# Altium project Earendel_Rules_Enabled_V2.PrjPcb
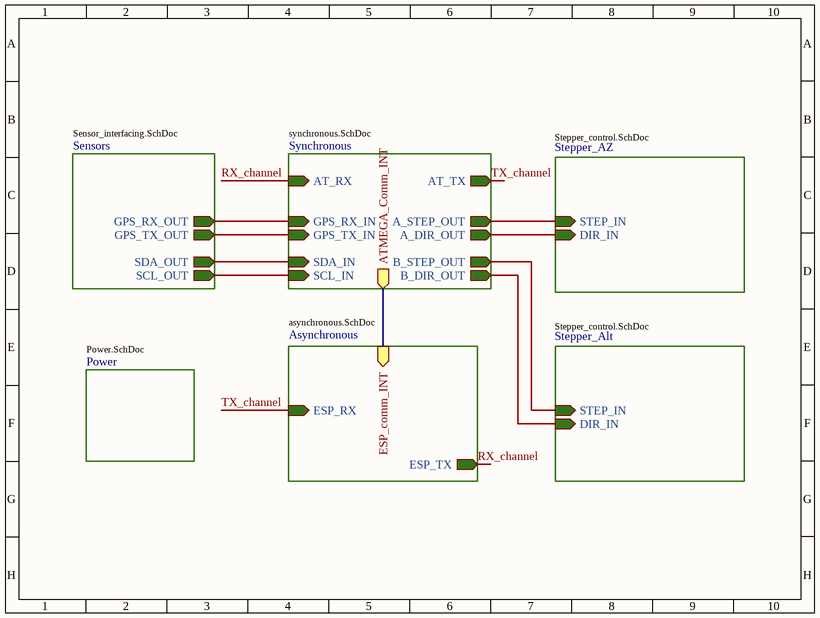
[diagram p0: Top_domain.SchDoc]
3 sheets, 26 parts. Net scope: hierarchical (ports join the sheet entries above them; power ports are global).
Board file: PCBmain.PcbDoc
Sheets:
  Top_domain.SchDoc
    Power = Power.SchDoc
    Synchronous = synchronous.SchDoc

## Sheet Top_domain.SchDoc
size 152 x 114 mm; SheetNumber: 1; SheetTotal: 6

### Sub-sheets
Asynchronous = asynchronous.SchDoc (file not in this document): ESP_RX (in), ESP_TX (out), ESP_comm_INT (in)
Power = Power.SchDoc: no entries
Sensors = Sensor_interfacing.SchDoc (file not in this document): GPS_RX_OUT (out), GPS_TX_OUT (out), SDA_OUT (out), SCL_OUT (out)
Stepper_Alt = Stepper_control.SchDoc (file not in this document): STEP_IN (in), DIR_IN (in)
Stepper_AZ = Stepper_control.SchDoc (file not in this document): STEP_IN (in), DIR_IN (in)
Synchronous = synchronous.SchDoc: AT_TX (out), AT_RX (in), GPS_RX_IN (in), GPS_TX_IN (in), SDA_IN (in), SCL_IN (in), A_STEP_OUT (out), B_STEP_OUT (out), A_DIR_OUT (out), B_DIR_OUT (out), ATMEGA_Comm_INT (out)

### Nets
RX_channel: sheet Synchronous/AT_RX, sheet Asynchronous/ESP_TX
SCL: sheet Synchronous/SCL_IN, sheet Sensors/SCL_OUT
SDA: sheet Synchronous/SDA_IN, sheet Sensors/SDA_OUT
TX_channel: sheet Synchronous/AT_TX, sheet Asynchronous/ESP_RX
NetU1_4: sheet Synchronous/ATMEGA_Comm_INT, sheet Asynchronous/ESP_comm_INT
NetU1_5: sheet Synchronous/GPS_TX_IN, sheet Sensors/GPS_TX_OUT
NetU1_6: sheet Synchronous/GPS_RX_IN, sheet Sensors/GPS_RX_OUT
NetU1_11: sheet Synchronous/A_STEP_OUT, sheet Stepper_AZ/STEP_IN
NetU1_12: sheet Synchronous/B_STEP_OUT, sheet Stepper_Alt/STEP_IN
NetU1_13: sheet Synchronous/A_DIR_OUT, sheet Stepper_AZ/DIR_IN
NetU1_14: sheet Synchronous/B_DIR_OUT, sheet Stepper_Alt/DIR_IN

## Sheet Power.SchDoc
size 114 x 152 mm; SheetNumber: 4; SheetTotal: 6
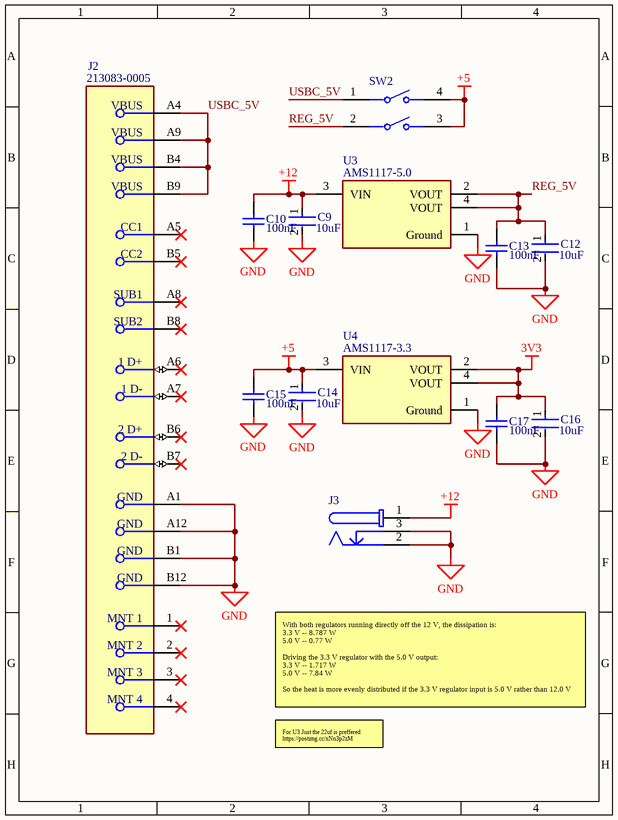
[diagram p1: Power.SchDoc]

### Parts
C9  Capacitance: 10uF  [FP-1206-L_3_2_0_2-W_1_6_0-IPC_B]  (hidden comment: 1206YD106KAT2A)
C10  value 100nF  [CAPC2013X140X50LL20T25]  (hidden comment: 08055F104KAT2A)
C12  Capacitance: 10uF  [FP-1206-L_3_2_0_2-W_1_6_0-IPC_B]  (hidden comment: 1206YD106KAT2A)
C13  value 100nF  [CAPC2013X140X50LL20T25]  (hidden comment: 08055F104KAT2A)
C14  Capacitance: 10uF  [FP-1206-L_3_2_0_2-W_1_6_0-IPC_B]  (hidden comment: 1206YD106KAT2A)
C15  value 100nF  [CAPC2013X140X50LL20T25]  (hidden comment: 08055F104KAT2A)
C16  Capacitance: 10uF  [FP-1206-L_3_2_0_2-W_1_6_0-IPC_B]  (hidden comment: 1206YD106KAT2A)
C17  value 100nF  [CAPC2013X140X50LL20T25]  (hidden comment: 08055F104KAT2A)
J2  213083-0005  [FP-2130830005-MFG]
J3  694106301002  [694106301002]  (value not drawn)
SW2  A6T-2104  [FP-A6T-2104-MFG]  (value not drawn)
U3  AMS1117-5.0  [FP-AMS1117-IPC_C]
U4  AMS1117-3.3  [FP-AMS1117-IPC_C]

### Nets
3V3: C16.1 C17.2 U4.2(VOUT) U4.4(VOUT)
+5: C14.1 C15.2 SW2.3 SW2.4 U4.3(VIN)
+12: C9.1 C10.2 J3.1 U3.3(VIN)
GND: C9.2 C10.1 C12.2 C13.1 C14.2 C15.1 C16.2 C17.1 J2.A1(GND) J2.A12(GND) J2.B1(GND) J2.B12(GND) J3.2 J3.3 U3.1(Ground) U4.1(Ground)
REG_5V: C12.1 C13.2 SW2.2 U3.2(VOUT) U3.4(VOUT)
USBC_5V: J2.A4(VBUS) J2.A9(VBUS) J2.B4(VBUS) J2.B9(VBUS) SW2.1

Not connected (* = marked no-connect by the designer): J2 1(MNT_1)* 2(MNT_2)* 3(MNT_3)* 4(MNT_4)* A5(CC1)* A6(1_D+)* A7(1_D-)* A8(SUB1)* B5(CC2)* B6(2_D+)* B7(2_D-)* B8(SUB2)*

### Notes on the sheet
- With both regulators running directly off the 12 V, the dissipation is:
  3.3 V -- 8.787 W
  5.0 V -- 0.77 W
  Driving the 3.3 V regulator with the 5.0 V output:
  3.3 V -- 1.717 W
  5.0 V -- 7.84 W
  So the heat is more evenly distributed if the 3.3 V regulator input is 5.0 V rather than 12.0 V
- For U3 Just the 22uf is preffered
  https://postimg.cc/xNn3p2zM

### Library data of the parts
C9 C12 C14 C16 = CMP-04427-000082-1: General Purpose Ceramic Capacitor, 1206, 10uF, 10%, X5R, 15%, 16V; Max Operating Temperature: 85°C; Tolerance: 10%; Dielectric: X5R; Series: -; Case Code (Imperial): 1206; Width: 1.6mm; Termination: SMD/SMT; Voltage Rating: 16V; REACH SVHC: No SVHC; Length: 3.2mm; Size: 1.78mm; Package Quantity: 1; Voltage: 16V; RoHS Compliant: Yes; Thickness: 0.07inch; Mount: Surface Mount; Radiation Hardening: No; Voltage Rating (DC): 16V; Min Operating Temperature: -55°C; Case Code (Metric): 3216; Construction: Flat; Depth: 1.6mm; Height: 0.07mm; Lead Free: Lead Free; Number of Pins: 2; Case/Package: 1206; Packaging: Tape and Reel
C10 C13 C15 C17 = CMP-2007-04784-1: Manufacturer: AVX Interconnect / Elco; Part Number: 08055F104KAT2A
J2 = CMP-04767-000030-2: CONN RCP USB2.0 TYP C 24P SMD RA; NexarPartId: 114105384; Current Rating: 5A; Number of Contacts: 16; Voltage Rating: 30V; Gender: Receptacle; Min Operating Temperature: -40°C; USB Standard: USB 2.0; Max Operating Temperature: 85°C; Contact Material: Gold, Nickel; Schedule B: 8536695050, 8536695050; Country of Origin: CN
J3 = CMP-1502-00188-2: NexarPartId: 52676100; Voltage Rating (DC): 20V; Gender: Male; Voltage Rating: 24V; Connector Type: Power; Insulation Resistance: 100MΩ; Current Rating: 5A; Shielding: Unshielded; Number of Contacts: 3; Color: Black; Housing Material: Polyamide; Contact Gender: Female; REACH SVHC: Unknown; Termination: Through Hole; Height: 11mm; RoHS: Compliant; Mount: Through Hole; Flammability Rating: UL94 V-0; Packaging: Bulk; Min Operating Temperature: -40°C; Contact Plating: Tin; Max Operating Temperature: 85°C; Operating Supply Voltage: 24V; Contact Material: Gold, Tin
SW2 = CMP-08827-000029-1: SWITCH SLIDE DIP SPST 25MA 24V; Pitch: 0.1inch; Contact Resistance: 200mR; Electrical Life: 1000Cycles; Number of Circuits: 2; Washable: No; Actuator Length: 0.6mm; Actuator Type: Slide (Standard); Max Current Rating: 25mA; Termination: PC Pins; Mount: Through Hole; Max Operating Temperature: 70°C; Throw Configuration: SPST; Packaging: Rail/Tube; Contact Current Rating: 25mA; Current Rating: 25mA; Case/Package: DIP; Width: 6.2mm; Radiation Hardening: No; Lead Free: Lead Free; Series: A6T; Package Quantity: 76; Voltage Rating (DC): 24V; Min Operating Temperature: -20°C; Contact Plating: Gold; Number of Positions: 2; Orientation: Straight; RoHS Compliant: Yes; Terminal Pitch: 2.54mm; Weight: 0.26g; Length: 0.237inch; Max Voltage Rating (DC): 24V; Mechanical Life: 1000Cycles; Height: 4.2mm; Contact Material: Gold
U3 = CMP-209535-000001-1: LDO Voltage Regulators 1A, 3.3V; Manufacturer Part Number: AMS1117-3.3; Manufacturer: Advanced Monolithic Systems; Dropout Voltage: 1.1V; Output Type: Fixed; Nominal Supply Current: 5mA; Max Power Dissipation: 1.2W; Max Supply Voltage: 15V; Number Of Outputs: 1; Standoff Height: 0.64mm; Max Junction Temp: +125°C; Height: 1.8mm; Package: AMS1117; Device Class L2: Power Management ICs; ComponentLink2Description: Datasheet; ComponentLink2URL: http://www.advanced-monolithic.com/pdf/ds1117.pdf; Category: IC; RoHS: TRUE; Automotive: No; Device Class L1: Integrated Circuits (ICs); Output Current: 1A; Device Class L3: Voltage Regulators - Linear; Temperature: -40°C to +125°C; Output Voltage: 3.3V; Temperature Range Low: -40°C; Octopart: https://octopart.com/ams1117-3.3-advanced+monolithic+systems-25899300; Lead Free: Yes; Ipc Land Pattern Name: SOT229P700X180-4; Temperature Range High: +125°C
U4 = CMP-209535-000001-1: LDO Voltage Regulators 1A, 3.3V; Manufacturer: Advanced Monolithic Systems; Dropout Voltage: 1.1V; Output Type: Fixed; Nominal Supply Current: 5mA; Max Power Dissipation: 1.2W; Max Supply Voltage: 15V; Number Of Outputs: 1; Standoff Height: 0.64mm; Max Junction Temp: +125°C; Height: 1.8mm; Package: AMS1117; Device Class L2: Power Management ICs; ComponentLink2Description: Datasheet; ComponentLink2URL: http://www.advanced-monolithic.com/pdf/ds1117.pdf; Category: IC; RoHS: TRUE; Automotive: No; Device Class L1: Integrated Circuits (ICs); Output Current: 1A; Device Class L3: Voltage Regulators - Linear; Temperature: -40°C to +125°C; Output Voltage: 3.3V; Manufacturer Part Number: AMS1117-3.3; Temperature Range Low: -40°C; Octopart: https://octopart.com/ams1117-3.3-advanced+monolithic+systems-25899300; Lead Free: Yes; Ipc Land Pattern Name: SOT229P700X180-4; Temperature Range High: +125°C

## Sheet synchronous.SchDoc
size 127 x 127 mm; SheetNumber: 3; SheetTotal: 6
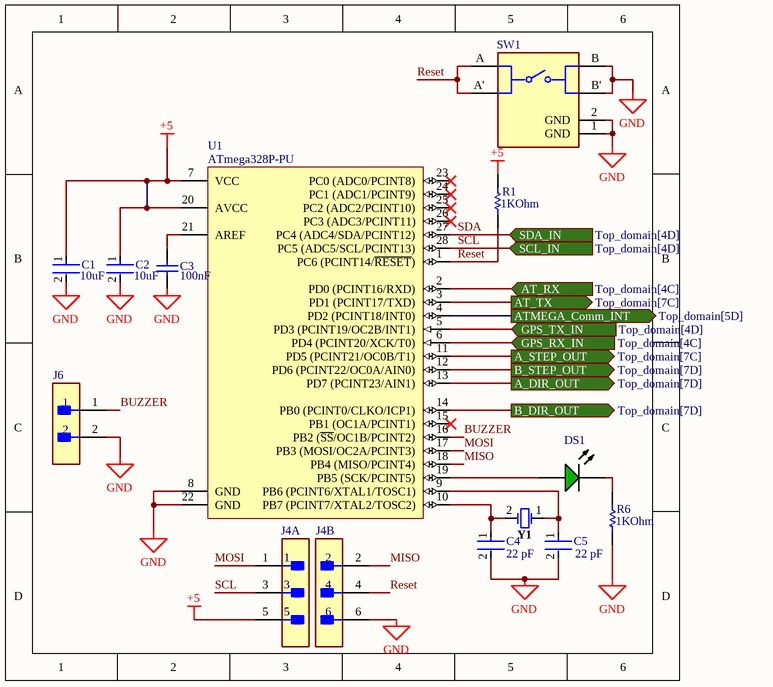
[diagram p2: synchronous.SchDoc]

### Parts
C1  Capacitance: 10uF  [FP-1206-L_3_2_0_2-W_1_6_0-IPC_B]  (hidden comment: 1206YD106KAT2A)
C2  Capacitance: 10uF  [FP-1206-L_3_2_0_2-W_1_6_0-IPC_B]  (hidden comment: 1206YD106KAT2A)
C3  value 100nF  [CAPC2013X140X50LL20T25]  (hidden comment: 08055F104KAT2A)
C4  Capacitance: 22 pF  [FP-C0805C-DN-MFG]  (hidden comment: C0805C220K3GACTU)
C5  Capacitance: 22 pF  [FP-C0805C-DN-MFG]  (hidden comment: C0805C220K3GACTU)
DS1  HSMG-C170  [AVAG-HSMX-C170_V]  (value not drawn)
J4  M20-9980346  [FP-M20-9980346-MFG]  (value not drawn)  (parts A,B of 2)
J6  B2B-XH-A(LF)(SN)  [FP-B2B-XH-A_LF_SN-MFG]  (value not drawn)
R1  Resistance: 1KOhm  [RESC2013X60X35ML10T20]  (hidden comment: RC0805FR-071KL)
R6  Resistance: 1KOhm  [RESC2013X60X35ML10T20]  (hidden comment: RC0805FR-071KL)
SW1  EVQ-PLMA15  [FP-EVQ-PLMA15-MFG]  (value not drawn)
U1  ATmega328P-PU  [28P3]
Y1  FOXSLF/160-20  [FOX-FOXSLF160-20]  (value not drawn)

### Ports
A_DIR_OUT (out, see Top_domain[7D]), A_STEP_OUT (out, see Top_domain[7C]), AT_RX (in, see Top_domain[4C]), AT_TX (out, see Top_domain[7C]), ATMEGA_Comm_INT (out, see Top_domain[5D]), B_DIR_OUT (out, see Top_domain[7D]), B_STEP_OUT (out, see Top_domain[7D]), GPS_RX_IN (in, see Top_domain[4C]), GPS_TX_IN (in, see Top_domain[4D]), SCL_IN (in, see Top_domain[4D]), SDA_IN (in, see Top_domain[4D])

### Nets
+5: C1.1 C2.1 J4.5 R1.2 U1.7(VCC) U1.20(AVCC)
GND: C1.2 C2.2 C3.1 C4.2 C5.2 J4.6 J6.2 R6.1 SW1.1(GND) SW1.2(GND) SW1.B SW1.B' U1.8(GND) U1.22(GND)
BUZZER: J6.1 U1.16(PB2_(~{SS}/OC1B/PCINT2))
MISO: J4.2 U1.18(PB4_(MISO/PCINT4))
MOSI: J4.1 U1.17(PB3_(MOSI/OC2A/PCINT3))
Reset: J4.4 R1.1 SW1.A SW1.A' U1.1(PC6_(PCINT14/~{RESET}))
RX_channel: U1.2(PD0_(PCINT16/RXD)) ; port AT_RX
SCL: J4.3 U1.28(PC5_(ADC5/SCL/PCINT13)) ; port SCL_IN
SDA: U1.27(PC4_(ADC4/SDA/PCINT12)) ; port SDA_IN
TX_channel: U1.3(PD1_(PCINT17/TXD)) ; port AT_TX
NetC3_2: C3.2 U1.21(AREF)
NetC4_1: C4.1 U1.10(PB7_(PCINT7/XTAL2/TOSC2)) Y1.2
NetC5_1: C5.1 U1.9(PB6_(PCINT6/XTAL1/TOSC1)) Y1.1
NetDS1_1: DS1.1(A) U1.19(PB5_(SCK/PCINT5))
NetDS1_2: DS1.2(K) R6.2
NetU1_4: U1.4(PD2_(PCINT18/INT0)) ; port ATMEGA_Comm_INT
NetU1_5: U1.5(PD3_(PCINT19/OC2B/INT1)) ; port GPS_TX_IN
NetU1_6: U1.6(PD4_(PCINT20/XCK/T0)) ; port GPS_RX_IN
NetU1_11: U1.11(PD5_(PCINT21/OC0B/T1)) ; port A_STEP_OUT
NetU1_12: U1.12(PD6_(PCINT22/OC0A/AIN0)) ; port B_STEP_OUT
NetU1_13: U1.13(PD7_(PCINT23/AIN1)) ; port A_DIR_OUT
NetU1_14: U1.14(PB0_(PCINT0/CLKO/ICP1)) ; port B_DIR_OUT

Not connected (* = marked no-connect by the designer): U1 15(PB1_(OC1A/PCINT1))* 23(PC0_(ADC0/PCINT8))* 24(PC1_(ADC1/PCINT9))* 25(PC2_(ADC2/PCINT10))* 26(PC3_(ADC3/PCINT11))*

### Library data of the parts
C1 C2 = CMP-04427-000082-1: as C9 on sheet Power; Max Operating Temperature: 85°C; Tolerance: 10%; Dielectric: X5R; Series: -; Case Code (Imperial): 1206; Width: 1.6mm; Termination: SMD/SMT; Voltage Rating: 16V; REACH SVHC: No SVHC; Length: 3.2mm; Size: 1.78mm; Package Quantity: 1; Voltage: 16V; RoHS Compliant: Yes; Thickness: 0.07inch; Mount: Surface Mount; Radiation Hardening: No; Voltage Rating (DC): 16V; Min Operating Temperature: -55°C; Case Code (Metric): 3216; Construction: Flat; Depth: 1.6mm; Height: 0.07mm; Lead Free: Lead Free; Number of Pins: 2; Case/Package: 1206; Packaging: Tape and Reel
C3 = CMP-2007-04784-1: Manufacturer: AVX Interconnect / Elco; Part Number: 08055F104KAT2A
C4 C5 = CMP-2007-00528-2: CAP CER 22PF 25V 10% NP0 0805; Manufacturer: KEMET; Temperature Coefficient: 30ppm/°C; Temperature Characteristic: C0G; Material: Ceramic; Tolerance: 0.1; Temperature Range High: +125°C; Value: 22 pF; Temperature Range Low: -55°C; Category: Cap; Manufacturer Part Number: C0805C220K3GACTU; Automotive: No; Lead Free: Yes; Voltage Rating: 25 V; ComponentLink2URL: https://content.kemet.com/datasheets/KEM_C1003_C0G_SMD.pdf; Package: C0805C-DN; ComponentLink2Description: Datasheet; Device Class L2: Capacitors; RoHS: TRUE; Height: 0.88mm; Device Class L3: Ceramic Capacitors; Octopart: https://octopart.com/c0805c220k3gactu-kemet-12580612; Digikey Description: CAP CER 22PF 25V 10% NP0 0805; Temperature: -55°C to +125°C; Device Class L1: Passive Components; Ipc Land Pattern Name: CAPC200125X78; Mouser Description: Multilayer Ceramic Capacitors MLCC - SMD/SMT 25volts 22pF C0G 10%
DS1 = CMP-2000-05062-1: Chip LED, Green, 2.2 V, -40 to 85 degC, 2-Pin SMD, Pb-Free, Tape and Reel; Manufacturer: Avago; No. of Pins: 2; Peak Wavelength: 570nm; SVHC: NoSVHC(16-Jun-2014); Dominant Wavelength: 572nm; Forward Current If: 20mA; Viewing Angle: 170deg; Lens Shape: Rectangular; PIV Max: 5V; External Width: 1.25mm; LED Type: Standard; External Depth: 0.8mm; Opto Mounting Orientation: Top; Luminous Intensity: 15mcd; Luminous Intensity Min: 4mcd; Forward Voltage VF Max: 2.6V; External Length / Height: 2mm; Bulb Size: 1.25mmx1.4mm; Light Area Height: 1mm; Voltage Vf Typ: 2.2V; Operating Temperature Max: 85degC; Datasheet Version: Oct-08; MSL: MSL2A-4weeks; Peak Forward Current: 20mA; Package Description: 2-Pin Surface Mount Device, Body 2 x 1.25 mm, Height 0.8 mm; Datasheet URL: https://datasheet.ciiva.com/29280/180495-da-01-en-chip-led-hsmg-c170-gelb-gruen-29280971.pdf; Storage Temperature Min: -40degC; LED Colour: Green; Wavelength Typ: 570nm; Mounting Type: SMD; Forward Current If Max: 20mA; Dominant Wavelength Typ: 572nm; LED Mounting: SMD; Operating Temperature Range: -30degCto+85degC; Operating Temperature Min: -30degC; Manufacturer URL: http://www.avagotech.com/; Packaging: CutTape; Luminous Intensity Typ: 15mcd; Package Reference: HSMX-C170; Storage Temperature Max: 85degC; Opto Case Style: SMD; Forward Voltage: 2.2V
J4 = CMP-2000-06636-2: CONN HEADER VERT 6POS 2.54MM; Manufacturer: Harwin; Current Rating: 3A; Number Of Contacts: 6; Conn Gender: Male; Conn Orientation: Vertical; Device Class L1: Connectors; ComponentLink2Description: Datasheet; Height: 8.99mm; Temperature Range High: +105°C; Contact Material: Tin,Nickel; RoHS: TRUE; Temperature Range Low: -40°C; ComponentLink2URL: https://cdn.harwin.com/pdfs/M20-998.pdf; Digikey Description: CONN HEADER VERT 6POS 2.54MM; Pitch: 2.54mm; Package: M20-9980346; Device Class L2: Headers and Wire Housings; Manufacturer Part Number: M20-9980346; Number Of Rows: 2; Category: Conn; Lead Free: Yes; Mouser Description: 2.54mm (0.1") Pitch DIL Vertical PC Tail Pin Header, 6.1mm mating pin height, tin, 3+3 contacts; Temperature: -40°C to +105°C; Device Class L3: unset; Octopart: https://octopart.com/m20-9980346-harwin-5436545; Automotive: No
J6 = CMP-2000-05888-3: CONN HEADER VERT 2POS 2.5MM; Current Rating: 3A; Voltage Rating: 250V; Number of Contacts: 2; Contact Resistance: 20mR; Wire/Cable Gauge: 22AWG; Insulation Resistance: 1GR; Connector Type: Male Pin; Packaging: Bulk; Contact Material: Brass; Lead Free: Lead Free; Orientation: Straight; Contact Plating: Tin; Max Current Rating: 3A; Termination: Solder; Fastening Type: Detent; Depth: 5.75mm; Housing Material: Polyamide; REACH SVHC: No SVHC; Series: XH; Voltage Rating (AC): 250V; Number of Positions: 2; Color: Natural; Contact Type: Male Pin; Max Voltage Rating (DC): 250V; Pitch: 2.5mm; Lead Pitch: 2.5mm; Mount: Through Hole; Max Operating Temperature: 85°C; Length: 7.4mm; Max Voltage Rating (AC): 250V; Min Operating Temperature: -25°C; Number of Rows: 1; Housing Color: White
R1 R6 = CMP-2100-03671-1: Chip Resistor, 1 KOhm, +/- 1%, 125 mW, -55 to 155 degC, 0805 (2012 Metric), RoHS, Tape and Reel; Manufacturer: Yageo; Temperature Coefficient: 100ppm/degreesC; Voltage Rating (DC): 150V; Max Power Dissipation: 125mW; Number of Pins: 2; Number of Terminations: 2; Datasheet URL: http://www.yageo.com/NewPortal/yageodocoutput?fileName=/pdf/R-Chip/PYu-RC_Group_51_RoHS_L_5.pdf; Length: 0.079inch; Package Description: 2-Pin Surface Mounted Device, Body 2 x 1.25 mm; Depth: 1.25mm; Height: 0.024inch; Military Standard: Not; Case/Package: 0805; Package Reference: 0805; RoHSCompliant: true; Lead Free: LeadFree; Packaging: TapeandReel; Package Quantity: 1; Datasheet Version: Rev. 5, 10/2016; Tolerance: 1%; Min Operating Temperature: -55degC; Voltage Rating: 150V; Composition: ThickFilm; Case Code (Imperial): 0805; Power Rating: 125mW; Width: 0.049inch; Case Code (Metric): 2012; Manufacturer URL: http://www.yageo.com/; Max Operating Temperature: 155degC; REACH SVHC: Unknown; Termination: SMD/SMT
SW1 = CMP-05618-000006-1: SWITCH TACTILE SPST-NO 0.02A 15V; Manufacturer: Panasonic Electronic Components; Operating Force: 2.6N; Contact Resistance: 50mΩ; Contact Current Rating: 20mA; Electromechanical Life: 200000Cycles; Throw Configuration: SPST-NO; Automotive: No; Digikey Description: SWITCH TACTILE SPST-NO 0.02A 15V; Device Class L3: Tactile Switches; Device Class L2: Switches; Temperature Range Low: -20°C; ComponentLink2Description: Datasheet; RoHS: TRUE; Mount: Surface Mount; Package: 0; Height: 1.7mm; Octopart: https://octopart.com/evq-plma15-panasonic-39850235; Temperature Range High: +70°C; Device Class L1: Electromechanical; Category: Switch; Mouser Description: Tactile Switches FLAT ACT 2.6NF 4.6x3.4x1.5mm; Voltage Rating Dc: 15V; Manufacturer Part Number: EVQ-PLMA15; ComponentLink2URL: https://datasheet.ciiva.com/8164/atv0000ce2-8164994.pdf; Lead Free: Yes; Temperature: -20°C to +70°C
U1 = CMP-0095-00013-2: 8-bit AVR Microcontroller, 32KB Flash, 1KB EEPROM, 2KB SRAM, 28-pin PDIP, Industrial Grade (-40°C to 85°C); RevisionNote: DatasheetVersion updated. URLs added.; PackageVersion: revB, Sep-2001; PackageDescription: 28-lead (0.300"/7.62mm Wide) Plastic Dual Inline Package (PDIP); DatasheetVersion: revD, May-2011; ComponentLink1Description: Manufacturer URL; ComponentLink1URL: http://www.atmel.com/; PackageReference: 28P3; ComponentLink2Description: ATmega48A/48PA/88A/88PA/168A/168PA/328/328P Datasheet; ComponentLink3URL: http://www.atmel.com/dyn/resources/prod_documents/8271S.pdf; ComponentLink2URL: http://www.atmel.com/dyn/resources/prod_documents/8271.pdf; ComponentLink3Description: ATmega48A/48PA/88A/88PA/168A/168PA/328/328P Summary
Y1 = CMP-1749-00003-1: Resistance Weld Thru-Hole Crystal, 16 MHz, -20 to 70 degC, 2-Pin THD, RoHS, Bulk; Voltage Rating: 250 V; Tolerance: 1%; Resistance: 221 kohm; Case\Package: Axial; Power Rating: 250 mW; RoHSCompliant: true; Package Quantity: 200; Packaging: Bulk; Min Operating Temperature: -55 degC; DatasheetVersion: Mar-15; ComponentLink1URL: http://www.foxonline.com/; Max Operating Temperature: 155 degC; PackageReference: FOXSLF160-20; Mount: Through Hole; PackageDescription: 2-Pin Through Hole Device, Body 11.35 x 4.65 mm; ComponentLink1Description: Manufacturer URL; ComponentLink2URL: http://www.foxonline.com/pdfs/hc49slf.pdf; ComponentLink2Description: Datasheet; Length: 0.248 inch

## Nets that join several sheets
+5: Power (5 pins), synchronous (6 pins)
GND: Power (16 pins), synchronous (14 pins)